# EAGLE design ECG (EAGLE 7.6.0)
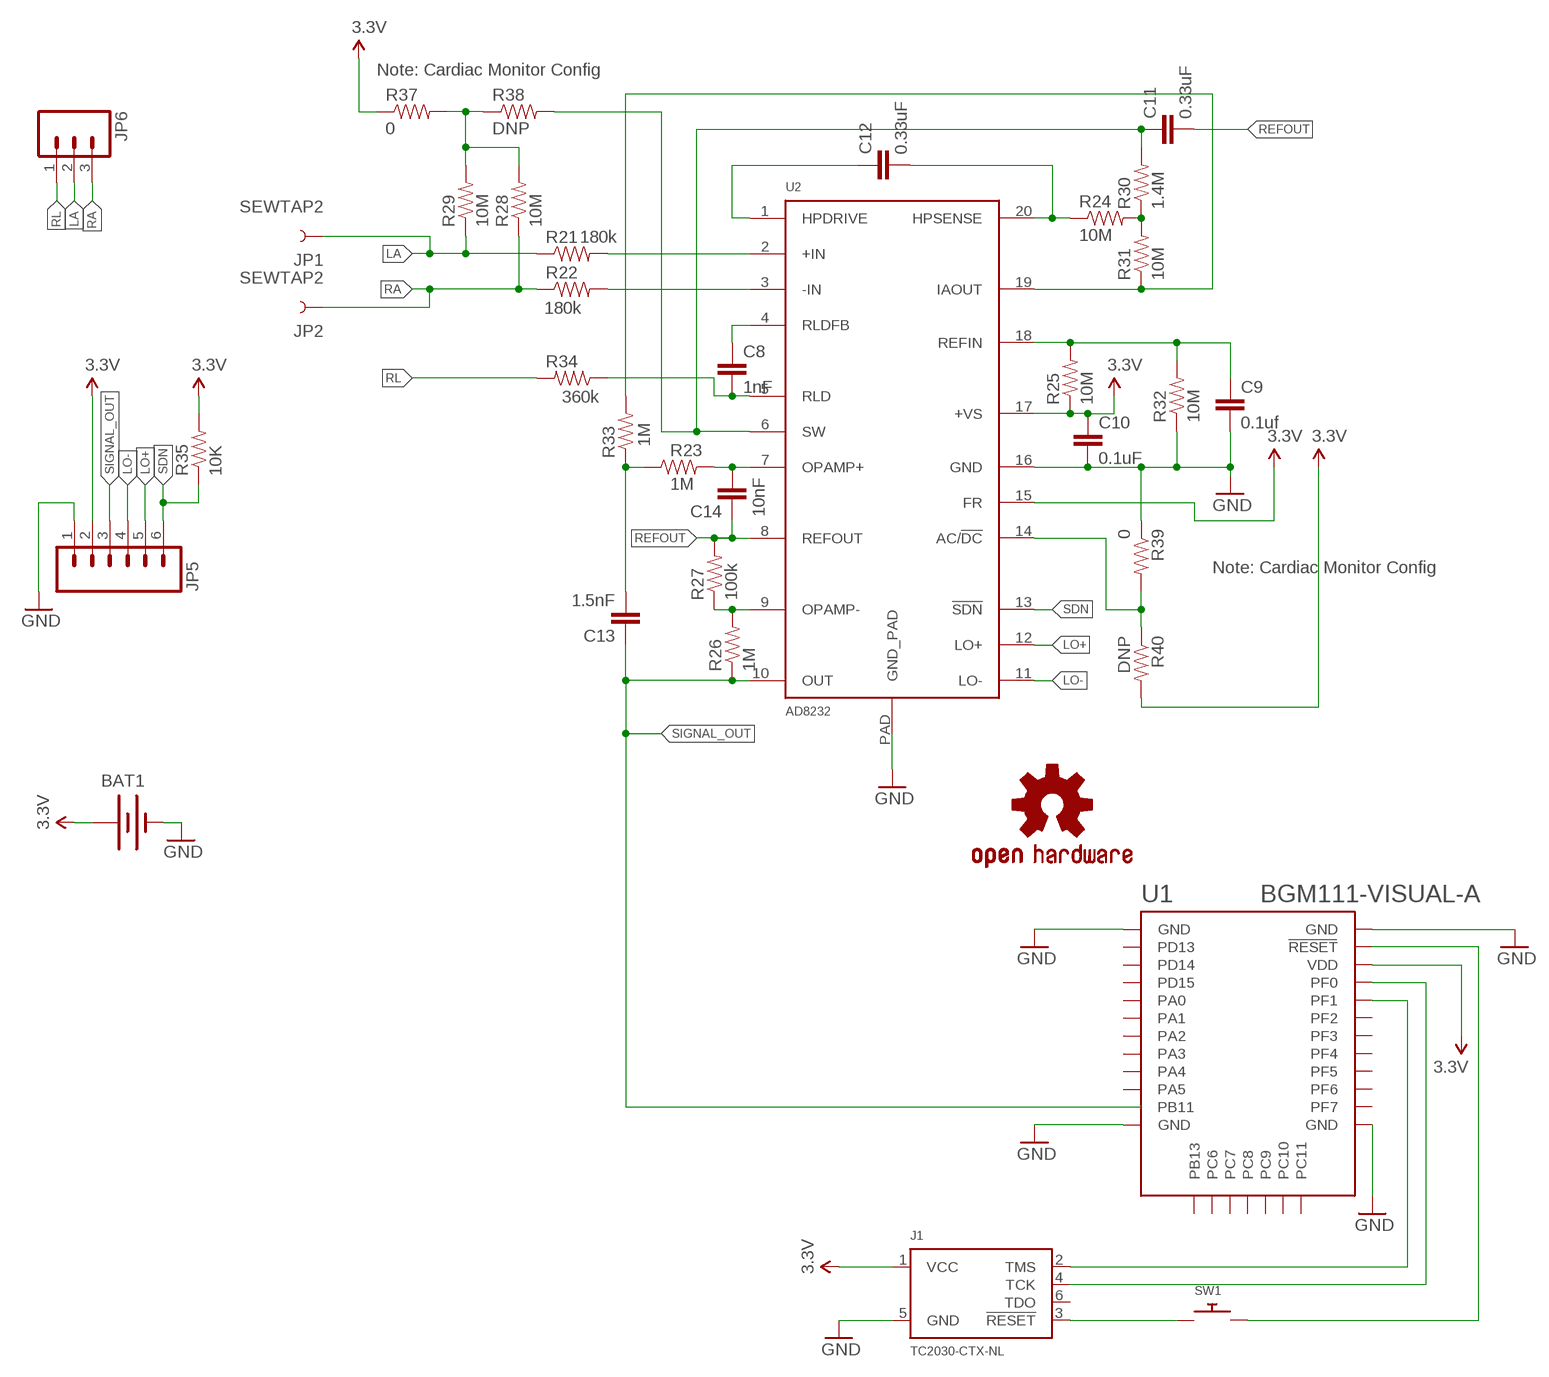
[diagram p0: schematic, sheet 1]

## Parts
BAT1  BATTERY20SMD  [BATTCON_20MM]
C8  1nF  CAP0603-CAP  [0603-CAP]
C9  0.1uf  CAP0603-CAP  [0603-CAP]
C10  0.1uF  CAP0603-CAP  [0603-CAP]
C11  0.33uF  CAP0805  [0805]
C12  0.33uF  CAP0805  [0805]
C13  1.5nF  CAP0603-CAP  [0603-CAP]
C14  10nF  CAP0603-CAP  [0603-CAP]
J1  TC2030-CTX-NL  [TC2030-IDC-NL]
JP1  SEWTAP2  [PETAL-LONG-2]
JP2  SEWTAP2  [PETAL-LONG-2]
JP5  M06SIP  [1X06]
JP6  M03PTH  [1X03]
LOGO3  OSHW-LOGOS  [OSHW-LOGO-S]
R21  180k  RESISTOR0603-RES  [0603-RES]
R22  180k  RESISTOR0603-RES  [0603-RES]
R23  1M  RESISTOR0603-RES  [0603-RES]
R24  10M  RESISTOR0603-RES  [0603-RES]
R25  10M  RESISTOR0603-RES  [0603-RES]
R26  1M  RESISTOR0603-RES  [0603-RES]
R27  100k  RESISTOR0603-RES  [0603-RES]
R28  10M  RESISTOR0603-RES  [0603-RES]
R29  10M  RESISTOR0603-RES  [0603-RES]
R30  1.4M  RESISTOR0603-RES  [0603-RES]
R31  10M  RESISTOR0603-RES  [0603-RES]
R32  10M  RESISTOR0603-RES  [0603-RES]
R33  1M  RESISTOR0603-RES  [0603-RES]
R34  360k  RESISTOR0603-RES  [0603-RES]
R35  10K  10KOHM1/10W1%(0603)0603  [0603-RES]
R37  0  0OHM1/10W5%(0603)  [0603]
R38  DNP  0OHM1/10W5%(0603)  [0603]
R39  0  0OHM1/10W5%(0603)  [0603]
R40  DNP  0OHM1/10W5%(0603)  [0603]
SW1  SWITCH_PUSHBUTTONSOFTTOUCHSMD_SJ  [PUSHBUTTON_SMD_SJ]
U1  BGM111-VISUAL-A  [BGM111-A]
U2  AD8232  [LFCSP_20]

## Nets
3.3V: BAT1.1(+) C10.1 J1.1(VCC) JP5.2 R25.1 R35.2 R37.1 R40.2 U1.VDD U2.15(FR) U2.17(+VS)
GND: BAT1.2(-) C9.2 C10.2 J1.5(GND) JP5.1 R32.1 R39.1 U1.GND U1.GND@2(GND) U1.GND@3(GND) U1.GND@4(GND) U2.16(GND) U2.PAD(GND_PAD)
LA: JP1.1 JP6.2 R21.1 R29.1
LO+: JP5.5 U2.12(LO+)
LO-: JP5.4 U2.11(LO-)
N$1: J1.3(!RESET) SW1.P$1
N$2: SW1.P$2 U1.RESET
N$3: J1.4(TCK) U1.PF0
N$4: J1.2(TMS) U1.PF1
N$12: R21.2 U2.2(+IN)
N$15: R22.2 U2.3(-IN)
N$19: C14.2 R23.2 U2.7(OPAMP+)
N$21: C12.2 R24.1 U2.20(HPSENSE)
N$22: C9.1 R25.2 R32.2 U2.18(REFIN)
N$23: R26.2 R27.1 U2.9(OPAMP-)
N$24: C12.1 U2.1(HPDRIVE)
N$25: R24.2 R30.1 R31.2
N$26: C11.1 R30.2 R38.2 U2.6(SW)
N$27: C8.1 U2.4(RLDFB)
N$28: C13.2 R23.1 R33.1
N$29: C8.2 R34.1 U2.5(RLD)
N$30: R31.1 R33.2 U2.19(IAOUT)
N$31: R28.2 R29.2 R37.2 R38.1
N$34: R39.2 R40.1 U2.14(AC/!DC)
RA: JP2.1 JP6.3 R22.1 R28.1
REFOUT: C11.2 C14.1 R27.2 U2.8(REFOUT)
RL: JP6.1 R34.2
SDN: JP5.6 R35.1 U2.13(!SDN)
SIGNAL_OUT: C13.1 JP5.3 R26.1 U2.10(OUT)
Unconnected: J1.6(TDO) U1.PA0 U1.PA1 U1.PA2 U1.PA3 U1.PA4 U1.PA5 U1.PB11 U1.PB13 U1.PC6 U1.PC7 U1.PC8 U1.PC9 U1.PC10 U1.PC11 U1.PD13 U1.PD14 U1.PD15 U1.PF2 U1.PF3 U1.PF4 U1.PF5 U1.PF6 U1.PF7

## Notes on the sheet
- Note: Cardiac Monitor Config
- Note: Cardiac Monitor Config

## Library data of the parts
BAT1 = SparkFun-Electromechanical:BATTERY: Battery Holders Various common sizes : AA, AAA, 18650 (PRT-12895), 20mm coin cell and 12mm coin cell. 20MM_4LEGS, BATT-10373
C8-C14 = SparkFun-Passives:CAP: Capacitor Standard 0603 ceramic capacitor, and 0.1" leaded capacitor.
J1 = tag_connector:TC2030-CTX: Tag Connect footprint for ARM JTAG. 10 pin ARM Cortex Debug Connector.
JP1 JP2 = LilyPad-Wearables:SEWTAP: Sew Taps for LilyPad Boards.
JP5 = SparkFun-Connectors:M06: Header 6 Standard 6-pin 0.1" header. Use with straight break away headers (SKU : PRT-00116), right angle break away headers (PRT-00553), swiss pins (PRT-00743), machine pins (PRT-00117), and female headers (PRT-00115). Molex polarized connector foot print use with SKU : PRT-08094 with associated crimp pins and housings. NOTES ON THE VARIANTS LOCK and LOCK_LONGPADS... This footprint was designed to help hold the alignment of a through-hole component (i.e. 6-pin header) while soldering it into place. You may notice that each hole has been shifted either up or down by 0.005 of an inch from it's more standard position (which is a perfectly straight line). This slight alteration caused the pins (the squares in the middle) to touch the edges of the holes. Because they are alternating, it causes a "brace" to hold the component in place. 0.005 has proven to be the perfect amount of "off-center" position when using our standard breakaway headers. Although looks a little odd when you look at the bare footprint, once you have a header in there, the alteration is very hard to notice. Also,if you push a header all the way into place, it is covered up entirely on the bottom side. This idea of altering the position of holes to aid alignment will be further integrated into the Sparkfun Library for other footprints. It can help hold any component with 3 or more connection pins.
JP6 = SparkFun-Connectors:M03: Header 3 Standard 3-pin 0.1" header. Use with straight break away headers (SKU : PRT-00116), right angle break away headers (PRT-00553), swiss pins (PRT-00743), machine pins (PRT-00117), and female headers (PRT-00115). Molex polarized connector foot print use with SKU : PRT-08232 with associated crimp pins and housings.
LOGO3 = SparkFun-Aesthetics:OSHW-LOGO: Open Source Hardware Logo This logo indicates the piece of hardware it is found on incorporates a OSHW license and/or adheres to the definition of open source hardware found here: http://freedomdefined.org/OSHW
R21-R34 = SparkFun-Passives:RESISTOR: Resistor Basic schematic elements and footprints for 0603, 1206, and PTH resistors.
R35 = SparkFun-Resistors:10KOHM1/10W1%(0603): RES-00824; PROD_ID: RES-00824
R37 R39 = SparkFun-Resistors:0OHM1/10W5%(0603): RES-08609; PROD_ID: RES-08609
R38 R40 = SparkFun-Resistors:0OHM1/10W5%(0603): RES-08609; PROD_ID: RES-08609; VALUE: 0
SW1 = adafruit:SWITCH_PUSHBUTTON: Buttons SOFTTOUCHSMD_SJ - Soft touch temporary push button (Super Junk Akihabara) Compatible with SKPMANE010 [Mouser: 688-SKPMAN] C&K_KSS = Digikey: KSS221GLFS
U1 = sf-bluegiga:BGM111-VISUAL: Bluetooth 4.1 (4.2 ready) low-energy module (Bluetooth Smart) - BGM111-A variant has an on-module ceramic chip antenna. BGM111-A variant includes keepout/restrict area. Antenna edge of the module should be flush up against the edge of the PCB. See datasheet for variant layout details. IT IS EXTREMELY IMPORTANT THAT YOU FOLLOW THE LAYOUT GUIDELINES FOR THIS MODULE IN ORDER TO ENSURE MAXIMUM RANGE. THIS MEANS THAT YOU NEED A SOLID GROUND PLANE EXTENDING IDEALLY 17 mm ON THE LEFT AND RIGHT SIDES OF THE MODULE, AS SHOWN IN THE DATASHEET. The Silicon Labs Blue Gecko BGM111 Bluetooth® Smart module integrates our next generation wireless SoC with a complete Bluetooth Smart software stack and antenna to provide a complete, pre-certified plug-and-play Bluetooth Smart solution. It solves one of the major customer roadblocks for fast time-to-market as it integrates antenna, software and RF certifications, saving months of engineering effort and testing. https://www.silabs.com/products/wireless/bluetooth/Pages/BGM111-bluetooth-smart-module.aspx https://github.com/jrowberg/sf-oshw Last updated 2015-09-02 by Jeff Rowberg <jeff@rowberg.net>; ANTENNA: On-module ceramic chip antenna
U2 = AD8232:AD8232

## Board
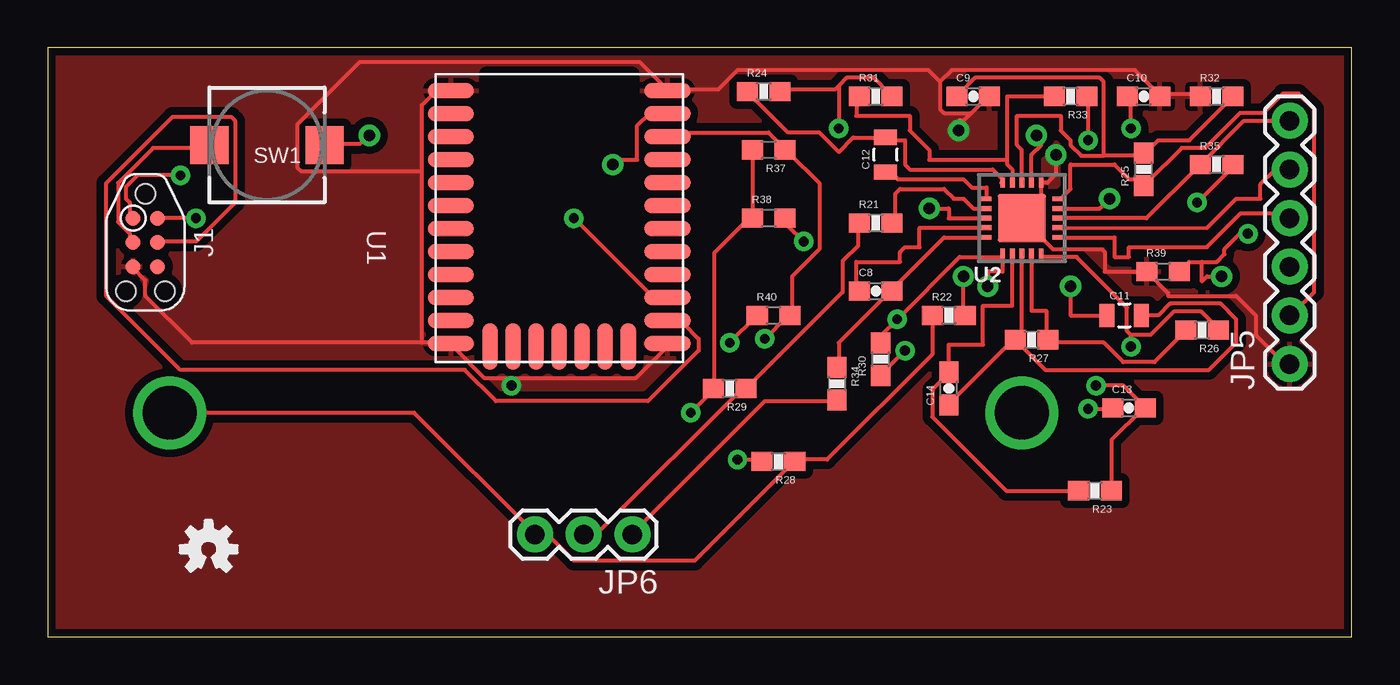
[diagram p1: board, top side]
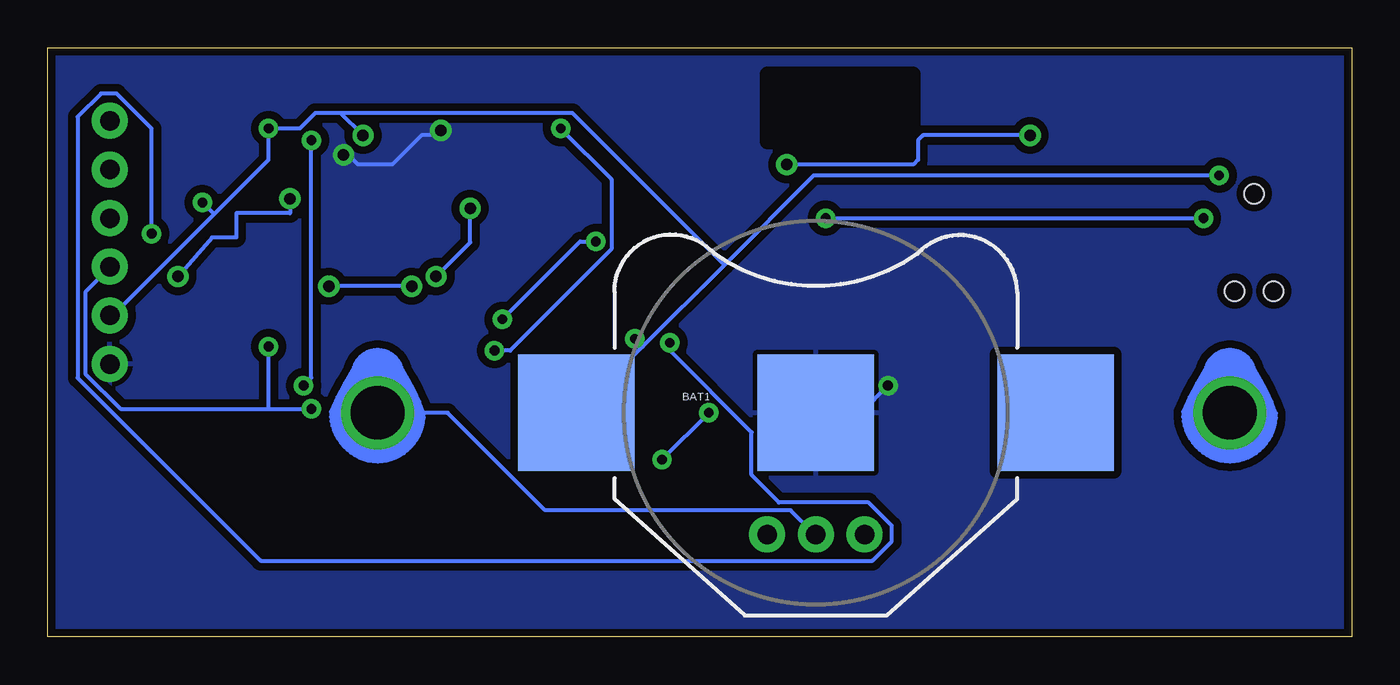
[diagram p2: board, bottom side, seen from below]

Size 68 x 30.72 mm. Coordinates in mm from the lower left corner, seen from the top.
Outline: 0,0 68,0 68,30.72 0,30.72 0,0
Copper layers (1*16): Top 0.035mm / dielectric 1.5mm / Bottom 0.035mm
Design rules "SparkFun": minimum track width 8mil, minimum drill 20mil, track to track 8mil, track to pad 8mil, pad to pad 8mil, via to via 8mil, smd to smd 8mil, copper to edge 10mil, drill to drill 8mil, minimum pad ring 12mil, minimum via ring 10mil, stop-mask expansion 4mil, vias tented up to drill 25mil, thermal gap 10mil

### Footprints (pad centres in the part's own frame; a part is rotated, then mirrored left to right if it is on the bottom)
BATTCON_20MM = smd 6.07 x 6.07: 1 -12.5,0; 2 0,0; 3 12.5,0
0603-CAP = smd 1.1 x 1: 1 -0.85,0; 2 0.85,0
0805 = smd 0.8 x 1.2: 1 -0.9,0; 2 0.9,0
TC2030-IDC-NL = smd 0.787 x 0.787: 1 -1.27,-0.635; 2 -1.27,0.635; 3 0,-0.635; 4 0,0.635; 5 1.27,-0.635; 6 1.27,0.635 | hole 1.016: -2.54,0; 2.54,1.016; 2.54,-1.016
PETAL-LONG-2 = drill 2.794: 1 0,0
1X06 = drill 1.016 pad 1.88: 1 0,0; 2 2.54,0; 3 5.08,0; 4 7.62,0; 5 10.16,0; 6 12.7,0
1X03 = drill 1.016 pad 1.88: 1 0,0; 2 2.54,0; 3 5.08,0
0603-RES = smd 1.1 x 1: 1 -0.85,0; 2 0.85,0
0603 = smd 1.1 x 1: 1 -0.85,0; 2 0.85,0
PUSHBUTTON_SMD_SJ = smd 2 x 2: P$1 3,0; P$2 -3,0
BGM111-A = smd 2.4 x 0.8: GND -5.65,6.65; GND@2 -5.65,-6.55; GND@3 5.65,-6.55; GND@4 5.65,6.65; PA0 -5.65,1.85; PA1 -5.65,0.65; PA2 -5.65,-0.55; PA3 -5.65,-1.75; PA4 -5.65,-2.95; PA5 -5.65,-4.15; PB11 -5.65,-5.35; PD13 -5.65,5.45; PD14 -5.65,4.25; PD15 -5.65,3.05; PF0 5.65,-5.35; PF1 5.65,-4.15; PF2 5.65,-2.95; PF3 5.65,-1.75; PF4 5.65,-0.55; PF5 5.65,0.65; PF6 5.65,1.85; PF7 5.65,3.05; RESET 5.65,5.45; VDD 5.65,4.25 | smd 0.8 x 2.4: PB13 -3.6,-6.7; PC6 -2.4,-6.7; PC7 -1.2,-6.7; PC8 0,-6.7; PC9 1.2,-6.7; PC10 2.4,-6.7; PC11 3.6,-6.7
LFCSP_20 = smd 0.5 x 0.25: 1 -1.85,1; 2 -1.85,0.5; 3 -1.85,0; 4 -1.85,-0.5; 5 -1.85,-1; 11 1.85,-1; 12 1.85,-0.5; 13 1.85,0; 14 1.85,0.5; 15 1.85,1 | smd 0.25 x 0.5: 6 -1,-1.85; 7 -0.5,-1.85; 8 0,-1.85; 9 0.5,-1.85; 10 1,-1.85; 16 1,1.85; 17 0.5,1.85; 18 0,1.85; 19 -0.5,1.85; 20 -1,1.85 | smd 2.5 x 2.5: PAD 0,0

### Placement (x,y rotation side)
BAT1  27.94,11.68 0 bottom
C8  43.18,18.03 0 top
C9  48.26,28.19 0 top
C10  57.15,28.19 0 top
C11  56.13,16.76 0 top
C12  43.69,25.15 90 top
C13  56.39,11.94 0 top
C14  46.99,12.95 90 top
J1  5.08,20.57 270 top
JP1  50.8,11.68 0 bottom
JP2  6.35,11.68 0 bottom
JP5  64.77,14.22 90 top
JP6  30.48,5.33 180 top
LOGO3  8.38,4.57 0 top
R21  43.18,21.59 0 top
R22  46.99,16.76 0 top
R23  54.61,7.62 180 top
R24  37.34,28.45 0 top
R25  57.15,24.38 90 top
R26  60.2,16 180 top
R27  51.31,15.49 180 top
R28  38.1,9.14 180 top
R29  35.56,12.95 180 top
R30  43.43,14.48 90 top
R31  43.18,28.19 0 top
R32  60.96,28.19 0 top
R33  53.34,28.19 180 top
R34  41.15,13.21 270 top
R35  60.96,24.64 0 top
R37  37.59,25.4 180 top
R38  37.59,21.84 0 top
R39  58.17,19.05 0 top
R40  37.85,16.76 0 top
SW1  11.43,25.65 180 top
U1  26.67,21.84 0 top
U2  50.8,21.84 0 top

### Tracks (layer width: path | path; a pad name or v marks a point on that pad's centre or on a via)
3.3V  (via drill 0.51, 0.6)
  Top 0.203: U2.15 52.83,22.86 53.34,23.37 53.34,24.64 55.63,24.64 56.39,23.88 56.64,23.88 56.98,23.53 R25.1 | 57.1,23.47 R25.1 | v56.49,26.52 56.49,28.14 C10.1 | v59.94,22.66 61.77,24.49 R35.2 | R25.1 57.3,23.67 59.13,25.5 60.35,25.5 62.18,27.33 63.4,27.33 64.41,28.35 65.23,28.35 66.04,27.53 66.04,17.98 64.82,16.76 JP5.2 | U1.VDD 32.51,26.11 32.72,26.31 37.59,26.31 38.41,25.5 R37.1 38.61,25.3 40.23,23.67 40.23,20.22 38.81,18.8 38.81,16.76 R40.2 38.61,16.76 v37.39,15.54 | v6.91,24.08 4.67,24.08 4.06,23.47 4.06,22.86 4.27,22.66 4.27,21.84 J1.1 | U2.17 51.31,25.15 51.82,25.65 v51.56,26.16
  Bottom 0.203: 59.33,22.05 64.62,16.76 JP5.2 | 59.33,22.05 56.49,24.89 v56.49,26.52 54.86,26.52 54.05,27.33 52.73,27.33 | 59.33,22.05 v59.94,22.66 | v6.91,24.08 28.04,24.08 32.72,19.41 | 36.98,15.14 BAT1.1 | 36.98,15.14 32.72,19.41 | 36.98,15.14 v37.39,15.54 | 52.73,27.33 40.64,27.33 32.72,19.41 | v51.56,26.16 52.73,27.33
GND  (via drill 0.51, 0.6)
  Top 0.203: 19.51,15.34 20.93,15.34 U1.GND@2 21.13,15.14 22.76,13.51 24.18,13.51 | 19.51,15.34 7.52,15.34 5.08,17.78 5.08,18.59 4.47,19.2 J1.5 | 19.51,15.34 19.51,24.28 | 19.51,24.28 19.51,27.74 20.12,28.35 20.93,28.35 U1.GND | 24.18,13.51 30.68,13.51 32.31,15.14 U1.GND@3 | 24.18,13.51 v24.18,13.11 | 48.16,27.33 48.97,28.14 C9.2 | 48.16,27.33 46.74,27.33 46.53,27.53 46.53,28.96 | 46.53,28.96 47.14,29.57 56.69,29.57 57.91,28.35 C10.2 58.12,28.35 59.94,28.35 R32.1 | 46.53,28.96 45.92,29.57 35.97,29.57 34.95,28.55 32.51,28.55 U1.GND@4 32.31,28.55 30.89,29.97 16.26,29.97 13.01,26.72 13.01,24.49 13.21,24.28 19.51,24.28 | 48.16,27.33 47.75,26.92 47.5,26.92 v47.5,26.42 | v52.58,25.15 52.58,24.13 52.14,23.69 U2.16 51.82,23.67 51.82,22.86 U2.PAD 52.43,20.22 54.97,20.22 55.12,20.07 55.12,19.05 R39.1 58.42,17.95 58.42,17.78 61.98,17.78 62.99,16.76 62.99,15.75 64.52,14.22 JP5.1
  Bottom 0.203: BAT1.2 25.6,11.68 v24.18,13.11 | v47.5,26.42 47.75,26.16 48.51,26.16 50.04,24.64 51.82,24.64 52.32,25.15 v52.58,25.15
  pour Bottom (isolate 0.406, rank 6): 0,0 0,30.73 68.07,30.73 68.07,0
  pour Top (isolate 0.406, rank 6): 0,0 0,30.73 68.07,30.73 68.07,0
LA
  Top 0.203: JP6.2 28.04,5.38 28.65,5.38 36.37,13.11 R29.1 36.58,13.11 41.45,17.98 41.45,19.61 42.27,20.42 42.27,21.53 R21.1
  Bottom 0.203: JP1.1 47.14,11.68 42.06,6.6 29.26,6.6 28.04,5.38 JP6.2
LO+
  Top 0.203: U2.12 60.45,21.34 61.98,22.86 63.25,22.86 63.25,23.62 64.01,24.38 JP5.5
LO-
  Top 0.203: U2.11 52.83,20.83 55.63,20.83 55.63,19.81 56.39,19.81 56.39,20.32 60.45,20.32 62.23,22.1 63.75,22.1 JP5.4
N$1
  Top 0.203: J1.3 4.27,20.62 4.27,21.03 3.66,21.64 3.66,23.67 5.49,25.5 8.33,25.5 SW1.P$1
N$2  (via drill 0.6)
  Top 0.203: SW1.P$2 14.63,25.7 16.26,25.7 16.71,26.16 v16.76,26.16 | U1.RESET 32.31,27.33 31.39,27.33 30.73,26.67 30.73,24.89 29.72,24.89 v29.46,24.64
  Bottom 0.203: v16.76,26.16 22.35,26.16 22.61,25.91 22.61,24.89 22.86,24.64 v29.46,24.64
N$3
  Top 0.203: J1.4 5.89,20.62 7.72,20.62 9.75,22.66 9.75,26.92 9.55,27.13 6.5,27.13 3.05,23.67 3.05,17.78 6.91,13.92 21.74,13.92 23.37,12.29 31.29,12.29 33.93,14.93 33.93,15.54 33.12,16.36 32.51,16.36 U1.PF0
N$4  (via drill 0.51)
  Top 0.203: v7.72,21.84 J1.2 | v27.43,21.84 31.5,17.78 32.31,17.78 U1.PF1
  Bottom 0.203: v27.43,21.84 v7.72,21.84
N$12
  Top 0.203: R21.2 44.2,21.76 44.2,23.11 44.45,23.37 46.74,23.37 47.24,22.86 47.75,22.86 48.27,22.34 U2.2
N$15  (via drill 0.6)
  Top 0.203: R22.2 47.75,16.85 v47.75,18.8 | v45.97,22.35 46.99,22.35 46.99,21.84 U2.3
  Bottom 0.203: v47.75,18.8 45.97,20.57 v45.97,22.35
N$19
  Top 0.203: R23.2 49.99,7.62 46.13,11.48 46.13,12.9 46.94,13.72 C14.2 46.99,15.24 48.77,15.24 48.77,17.27 50.29,17.27 U2.7
N$21
  Top 0.203: 49.78,23.88 U2.20 | R24.1 36.58,28.35 38.61,26.31 40.23,26.31 41.25,25.3 42,26.05 C12.2 43.83,25.91 44.7,25.91 44.7,24.64 44.96,24.38 49.28,24.38 49.8,23.86 U2.20 | 49.71,23.69 U2.20
N$22
  Top 0.203: 55.07,25.09 57.1,25.09 R25.2 57.3,25.3 57.91,25.91 59.54,25.91 61.77,28.14 R32.2 | 55.07,25.09 55.07,28.96 54.86,29.16 48.36,29.16 47.55,28.35 C9.1 | U2.18 50.8,25.4 50.55,25.65 50.55,27.18 52.83,27.18 52.83,26.42 53.34,25.91 53.34,25.65 53.9,25.09 55.07,25.09
N$23
  Top 0.203: R26.2 59.33,15.95 57.71,14.33 56.08,14.33 55.07,15.34 52.22,15.34 R27.1 52.07,15.49 52.07,17.02 51.3,17.02 U2.9
N$24
  Top 0.203: C12.1 43.83,24.38 44.33,23.88 47.75,23.88 48.19,23.44 48.95,23.44 U2.1
N$25  (via drill 0.51)
  Top 0.203: 41.25,28.75 41.66,29.16 43.08,29.16 43.89,28.35 R31.2 | 41.25,28.75 41.05,28.55 38.2,28.55 R24.2 | v44.7,14.93 43.48,13.72 R30.1 | 41.25,28.75 v41.25,26.52
  Bottom 0.203: v44.7,14.93 43.89,14.93 38.61,20.22 38.61,23.88 v41.25,26.52
N$26  (via drill 0.51, 0.6)
  Top 0.203: 49.78,19.81 47.55,19.81 v44.3,16.56 43.48,15.75 43.48,15.34 R30.2 | 49.78,19.81 U2.6 | v39.42,20.62 38.61,21.44 38.61,21.84 R38.2 | 49.78,19.81 49.78,19.05 49.02,19.05 v49.02,18.29 | v53.34,18.29 53.34,16.76 C11.1
  Bottom 0.203: v39.42,20.62 40.23,20.62 v44.3,16.56 | v49.02,18.29 v53.34,18.29
N$27
  Top 0.203: C8.1 42.16,18.2 42.16,19.56 44.45,19.56 44.45,20.07 44.7,20.32 45.47,20.32 45.47,21.34 U2.4
N$28  (via drill 0.51)
  Top 0.203: R23.1 55.47,7.62 55.47,10.26 57.1,11.89 C13.2 57.1,12.09 56.08,13.11 v54.66,13.11 | v54.25,25.91 54.25,28.14 R33.1
  Bottom 0.203: v54.25,25.91 54.25,13.51 v54.66,13.11
N$29
  Top 0.203: U2.5 48.77,20.83 46.74,20.83 44.09,18.19 C8.2 43.89,17.98 41.25,15.34 41.25,14.12 R34.1
N$30
  Top 0.203: R31.1 42.47,28.14 42.16,27.84 42.16,27.18 44.96,27.18 44.96,26.42 45.97,25.4 45.97,24.89 50.04,24.89 | 52.43,28.14 R33.2 | U2.19 50.3,24.38 50.04,24.64 50.04,24.89 | 52.49,27.77 R33.2 | R33.2 50.04,28.19 50.04,24.89
N$31  (via drill 0.51)
  Top 0.203: R37.2 36.78,25.3 36.78,21.84 R38.1 36.58,21.84 34.75,20.01 34.75,13.11 R29.2 34.75,12.9 v33.53,11.68 | v35.97,9.25 37.19,9.25 R28.2
  Bottom 0.203: v33.53,11.68 v35.97,9.25
N$34  (via drill 0.51, 0.6)
  Top 0.203: v35.56,15.34 36.98,16.76 R40.1 | v62.59,21.03 62.18,21.03 61.37,20.22 61.37,19.96 60.96,19.56 60.2,19.56 | R39.2 59.52,19.56 60.2,19.56 | U2.14 54.86,22.35 v55.37,22.86 | 60.2,19.56 60.2,18.54 60.45,18.8 v61.21,18.8
  Bottom 0.203: v35.56,15.34 35.56,14.93 31.29,10.67 31.29,8.43 29.87,7.01 25.2,7.01 23.98,5.79 23.98,4.98 24.99,3.96 56.9,3.96 66.45,13.51 66.45,27.13 65.23,28.35 64.41,28.35 62.59,26.52 v62.59,21.03 | v55.37,22.86 55.37,22.1 58.17,22.1 58.17,20.83 59.44,20.83 v61.21,18.8
RA
  Top 0.203: R22.1 46.13,16.76 46.13,14.73 40.64,9.25 39.01,9.25 R28.1 38.81,9.04 33.73,3.96 27.43,3.96 26.21,5.18 25.4,5.18 JP6.3 25.4,5.38 19.1,11.68 JP2.1
REFOUT
  Top 0.203: U2.8 50.8,15.75 50.6,15.54 R27.2 | C14.1 47.14,12.29 50.39,15.54 R27.2 | C11.2 57.91,16.76 58.52,17.37 61.16,17.37 61.98,16.56 61.98,15.34 60.55,13.92 52.02,13.92 50.6,15.34 R27.2
RL
  Top 0.203: R34.2 41.05,12.29 37.39,12.29 30.48,5.38 JP6.1
SDN
  Top 0.203: U2.13 57.3,21.84 59.94,24.49 R35.1 60.15,24.69 62.38,26.92 JP5.6
SIGNAL_OUT  (via drill 0.51)
  Top 0.203: 56.49,15.75 56.29,15.95 56.29,17.17 53.65,19.81 51.82,19.81 U2.10 | 56.49,15.75 57.51,15.75 58.73,16.97 60.15,16.97 60.96,16.15 R26.1 | v54.25,11.89 55.47,11.89 C13.1 | v56.49,15.14 56.49,15.75
  Bottom 0.203: 56.49,11.89 64.21,11.89 66.04,13.72 66.04,17.98 64.82,19.2 JP5.3 | 56.49,11.89 v54.25,11.89 | 56.49,11.89 v56.49,15.14